# Altium schematic sheet 2_DRAM.schdoc
size 302 x 215 mm; Symbol: Sheet_A4; Device: Sheet_A4; @Project Name: YuzukiH616; Company: YuzukiHD; Version: 1.0; @Page No: 2; @Page Count: 4; @Update Date: 2025-03-02; REV: 1.0; Date: 2021-09-08; Sheet: 1/1; Draw By: GloomyGhost; SheetNumber: 2; SheetTotal: 4
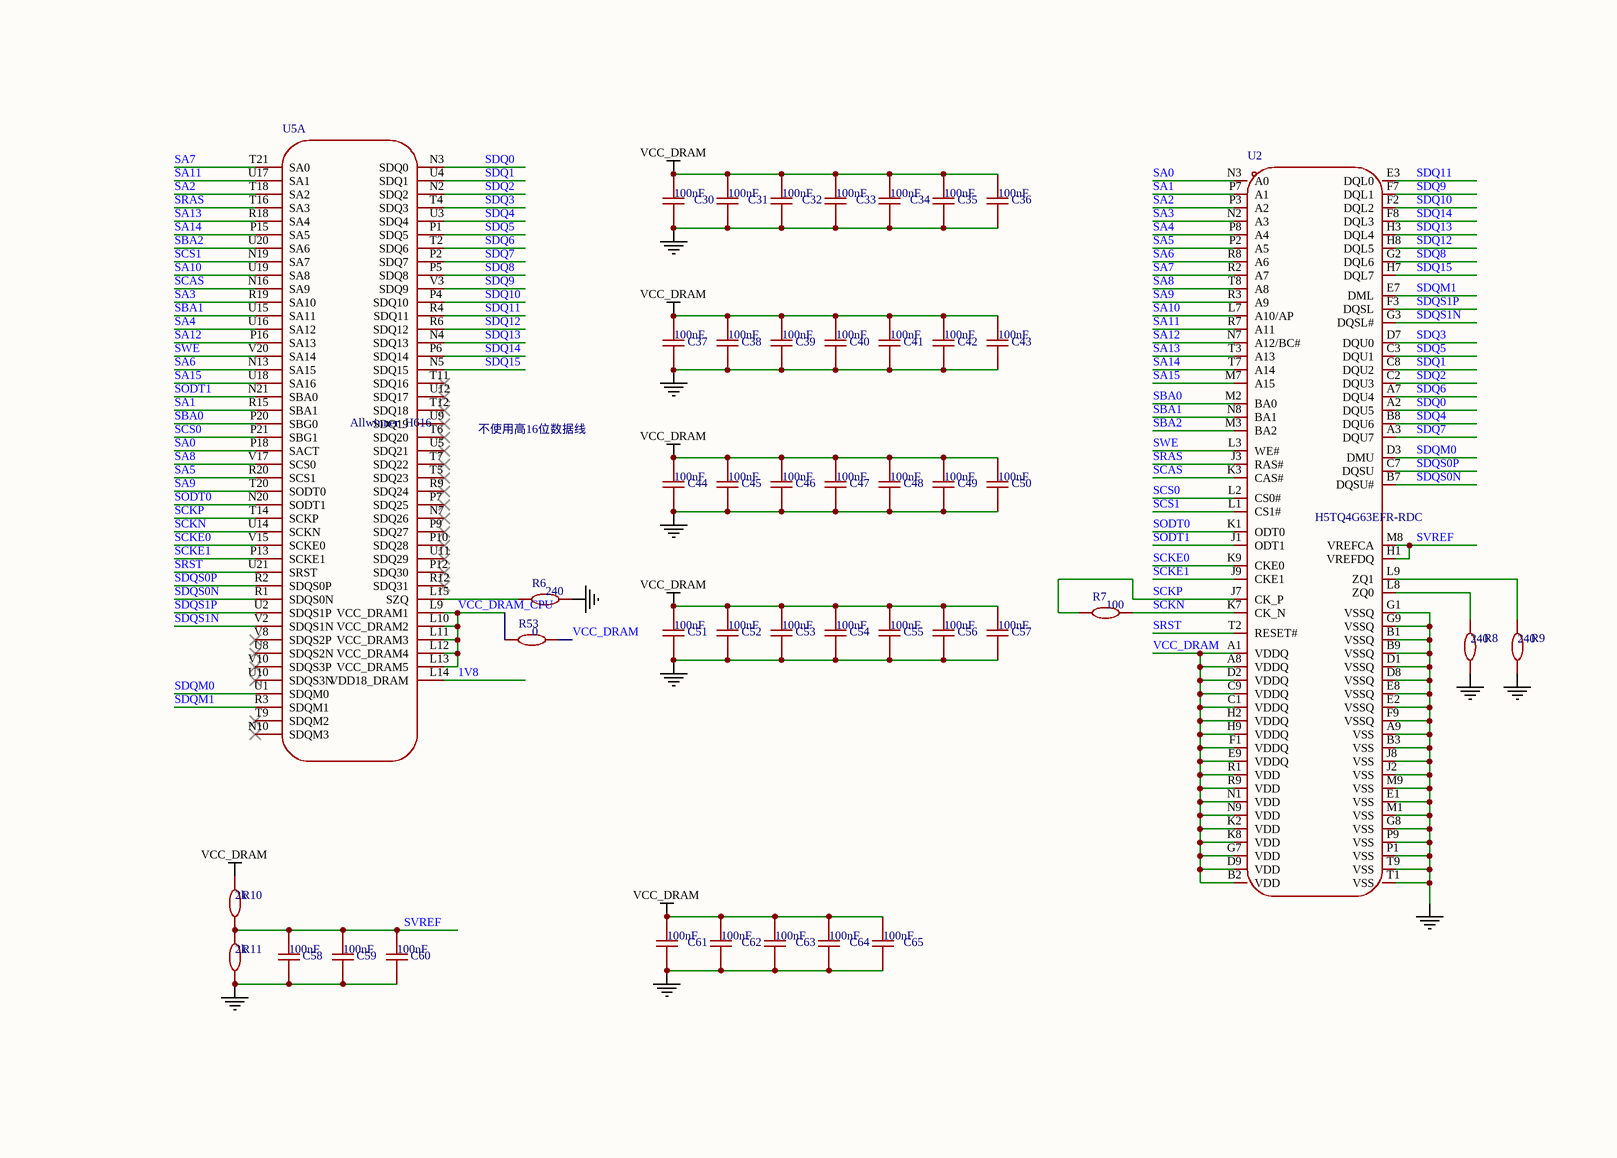
[diagram p0: 2_DRAM.schdoc]

## Parts
C30  100nF  [C0402-NSK]
C31  100nF  [C0402-NSK]
C32  100nF  [C0402-NSK]
C33  100nF  [C0402-NSK]
C34  100nF  [C0402-NSK]
C35  100nF  [C0402-NSK]
C36  100nF  [C0402-NSK]
C37  100nF  [C0402-NSK]
C38  100nF  [C0402-NSK]
C39  100nF  [C0402-NSK]
C40  100nF  [C0402-NSK]
C41  100nF  [C0402-NSK]
C42  100nF  [C0402-NSK]
C43  100nF  [C0402-NSK]
C44  100nF  [C0402-NSK]
C45  100nF  [C0402-NSK]
C46  100nF  [C0402-NSK]
C47  100nF  [C0402-NSK]
C48  100nF  [C0402-NSK]
C49  100nF  [C0402-NSK]
C50  100nF  [C0402-NSK]
C51  100nF  [C0402-NSK]
C52  100nF  [C0402-NSK]
C53  100nF  [C0402-NSK]
C54  100nF  [C0402-NSK]
C55  100nF  [C0402-NSK]
C56  100nF  [C0402-NSK]
C57  100nF  [C0402-NSK]
C58  100nF  [C0402-NSK]
C59  100nF  [C0402-NSK]
C60  100nF  [C0402-NSK]
C61  100nF  [C0402-NSK]
C62  100nF  [C0402-NSK]
C63  100nF  [C0402-NSK]
C64  100nF  [C0402-NSK]
C65  100nF  [C0402-NSK]
R6  240  [R0402-NSK_2]
R7  100  [R0402-NSK_2]
R8  240  [R0402-NSK_2]
R9  240  [R0402-NSK_2]
R10  2k  [R0402-NSK_2]
R11  2k  [R0402-NSK_2]
R53  0  [R0402-NSK_2]
U2  H5TQ4G63EFR-RDC  [FBGA96]
U5  Allwinner_H616  [BGA284P65B1200_1400H125]  (part A of 4)

## Nets
GND: C30.1 C31.1 C32.1 C33.1 C34.1 C35.1 C36.1 C37.1 C38.1 C39.1 C40.1 C41.1 C42.1 C43.1 C44.1 C45.1 C46.1 C47.1 C48.1 C49.1 C50.1 C51.1 C52.1 C53.1 C54.1 C55.1 C56.1 C57.1 C58.1 C59.1 C60.1 C61.1 C62.1 C63.1 C64.1 C65.1 R6.2 R8.1 R9.1 R11.1 U2.A9(VSS) U2.B1(VSSQ) U2.B3(VSS) U2.B9(VSSQ) U2.D1(VSSQ) U2.D8(VSSQ) U2.E1(VSS) U2.E2(VSSQ) U2.E8(VSSQ) U2.F9(VSSQ) U2.G1(VSSQ) U2.G8(VSS) U2.G9(VSSQ) U2.J2(VSS) U2.J8(VSS) U2.M1(VSS) U2.M9(VSS) U2.P1(VSS) U2.P9(VSS) U2.T1(VSS) U2.T9(VSS)
VCC_DRAM: C30.2 C31.2 C32.2 C33.2 C34.2 C35.2 C36.2 C37.2 C38.2 C39.2 C40.2 C41.2 C42.2 C43.2 C44.2 C45.2 C46.2 C47.2 C48.2 C49.2 C50.2 C51.2 C52.2 C53.2 C54.2 C55.2 C56.2 C57.2 C61.2 C62.2 C63.2 C64.2 C65.2 R10.2 R53.2 U2.A1(VDDQ) U2.A8(VDDQ) U2.B2(VDD) U2.C1(VDDQ) U2.C9(VDDQ) U2.D2(VDDQ) U2.D9(VDD) U2.E9(VDDQ) U2.F1(VDDQ) U2.G7(VDD) U2.H2(VDDQ) U2.H9(VDDQ) U2.K2(VDD) U2.K8(VDD) U2.N1(VDD) U2.N9(VDD) U2.R1(VDD) U2.R9(VDD)
1V8: U5.L14(VDD18_DRAM)
SA0: U2.N3(A0) U5.P18(SACT)
SA1: U2.P7(A1) U5.R15(SBA1)
SA2: U2.P3(A2) U5.T18(SA2)
SA3: U2.N2(A3) U5.R19(SA10)
SA4: U2.P8(A4) U5.U16(SA12)
SA5: U2.P2(A5) U5.R20(SCS1)
SA6: U2.R8(A6) U5.N13(SA15)
SA7: U2.R2(A7) U5.T21(SA0)
SA8: U2.T8(A8) U5.V17(SCS0)
SA9: U2.R3(A9) U5.T20(SODT0)
SA10: U2.L7(A10/AP) U5.U19(SA8)
SA11: U2.R7(A11) U5.U17(SA1)
SA12: U2.N7(A12/BC#) U5.P16(SA13)
SA13: U2.T3(A13) U5.R18(SA4)
SA14: U2.T7(A14) U5.P15(SA5)
SA15: U2.M7(A15) U5.U18(SA16)
SBA0: U2.M2(BA0) U5.P20(SBG0)
SBA1: U2.N8(BA1) U5.U15(SA11)
SBA2: U2.M3(BA2) U5.U20(SA6)
SCAS: U2.K3(CAS#) U5.N16(SA9)
SCKE0: U2.K9(CKE0) U5.V15(SCKE0)
SCKE1: U2.J9(CKE1) U5.P13(SCKE1)
SCKN: R7.2 U2.K7(CK_N) U5.U14(SCKN)
SCKP: R7.1 U2.J7(CK_P) U5.T14(SCKP)
SCS0: U2.L2(CS0#) U5.P21(SBG1)
SCS1: U2.L1(CS1#) U5.N19(SA7)
SDQ0: U2.A2(DQU5) U5.N3(SDQ0)
SDQ1: U2.C8(DQU2) U5.U4(SDQ1)
SDQ2: U2.C2(DQU3) U5.N2(SDQ2)
SDQ3: U2.D7(DQU0) U5.T4(SDQ3)
SDQ4: U2.B8(DQU6) U5.U3(SDQ4)
SDQ5: U2.C3(DQU1) U5.P1(SDQ5)
SDQ6: U2.A7(DQU4) U5.T2(SDQ6)
SDQ7: U2.A3(DQU7) U5.P2(SDQ7)
SDQ8: U2.G2(DQL6) U5.P5(SDQ8)
SDQ9: U2.F7(DQL1) U5.V3(SDQ9)
SDQ10: U2.F2(DQL2) U5.P4(SDQ10)
SDQ11: U2.E3(DQL0) U5.R4(SDQ11)
SDQ12: U2.H8(DQL5) U5.R6(SDQ12)
SDQ13: U2.H3(DQL4) U5.N4(SDQ13)
SDQ14: U2.F8(DQL3) U5.P6(SDQ14)
SDQ15: U2.H7(DQL7) U5.N5(SDQ15)
SDQM0: U2.D3(DMU) U5.U1(SDQM0)
SDQM1: U2.E7(DML) U5.R3(SDQM1)
SDQS0N: U2.B7(DQSU#) U5.R1(SDQS0N)
SDQS0P: U2.C7(DQSU) U5.R2(SDQS0P)
SDQS1N: U2.G3(DQSL#) U5.V2(SDQS1N)
SDQS1P: U2.F3(DQSL) U5.U2(SDQS1P)
SODT0: U2.K1(ODT0) U5.N20(SODT1)
SODT1: U2.J1(ODT1) U5.N21(SBA0)
SRAS: U2.J3(RAS#) U5.T16(SA3)
SRST: U2.T2(RESET#) U5.U21(SRST)
SVREF: C58.2 C59.2 C60.2 R10.1 R11.2 U2.H1(VREFDQ) U2.M8(VREFCA)
SWE: U2.L3(WE#) U5.V20(SA14)
VCC_DRAM_CPU: R53.1 U5.L9(VCC_DRAM1) U5.L10(VCC_DRAM2) U5.L11(VCC_DRAM3) U5.L12(VCC_DRAM4) U5.L13(VCC_DRAM5)
NetR6_1: R6.1 U5.L15(SZQ)
NetR8_2: R8.2 U2.L8(ZQ0)
NetR9_2: R9.2 U2.L9(ZQ1)

Not connected (* = marked no-connect by the designer): U5 N7(SDQ26)* N10(SDQM3)* P7(SDQ25)* P9(SDQ27)* P10(SDQ28)* P12(SDQ30)* R9(SDQ24)* R12(SDQ31)* T5(SDQ23)* T6(SDQ20)* T7(SDQ22)* T9(SDQM2)* T11(SDQ16)* T12(SDQ18)* U5(SDQ21)* U8(SDQS2N)* U9(SDQ19)* U10(SDQS3N)* U11(SDQ29)* U12(SDQ17)* V8(SDQS2P)* V10(SDQS3P)*

## Notes on the sheet
- 不使用高16位数据线
- 1
- 2
- 3
- 4
- 5
- A
- B
- C
- D
- TITLE:
- YuzukiH616
- REV:
- 1.0
- Company:
- Date:
- 2025-03-02
- 2021-09-08
- YuzukiHD
- Sheet:
- Drawn By:
- GloomyGhost
- Total:
- 1/1

## Library data of the parts
C30-C65 = CAP_0402
R6-R11 R53 = Res_0402